# EAGLE design panel (EAGLE 6.5.0)
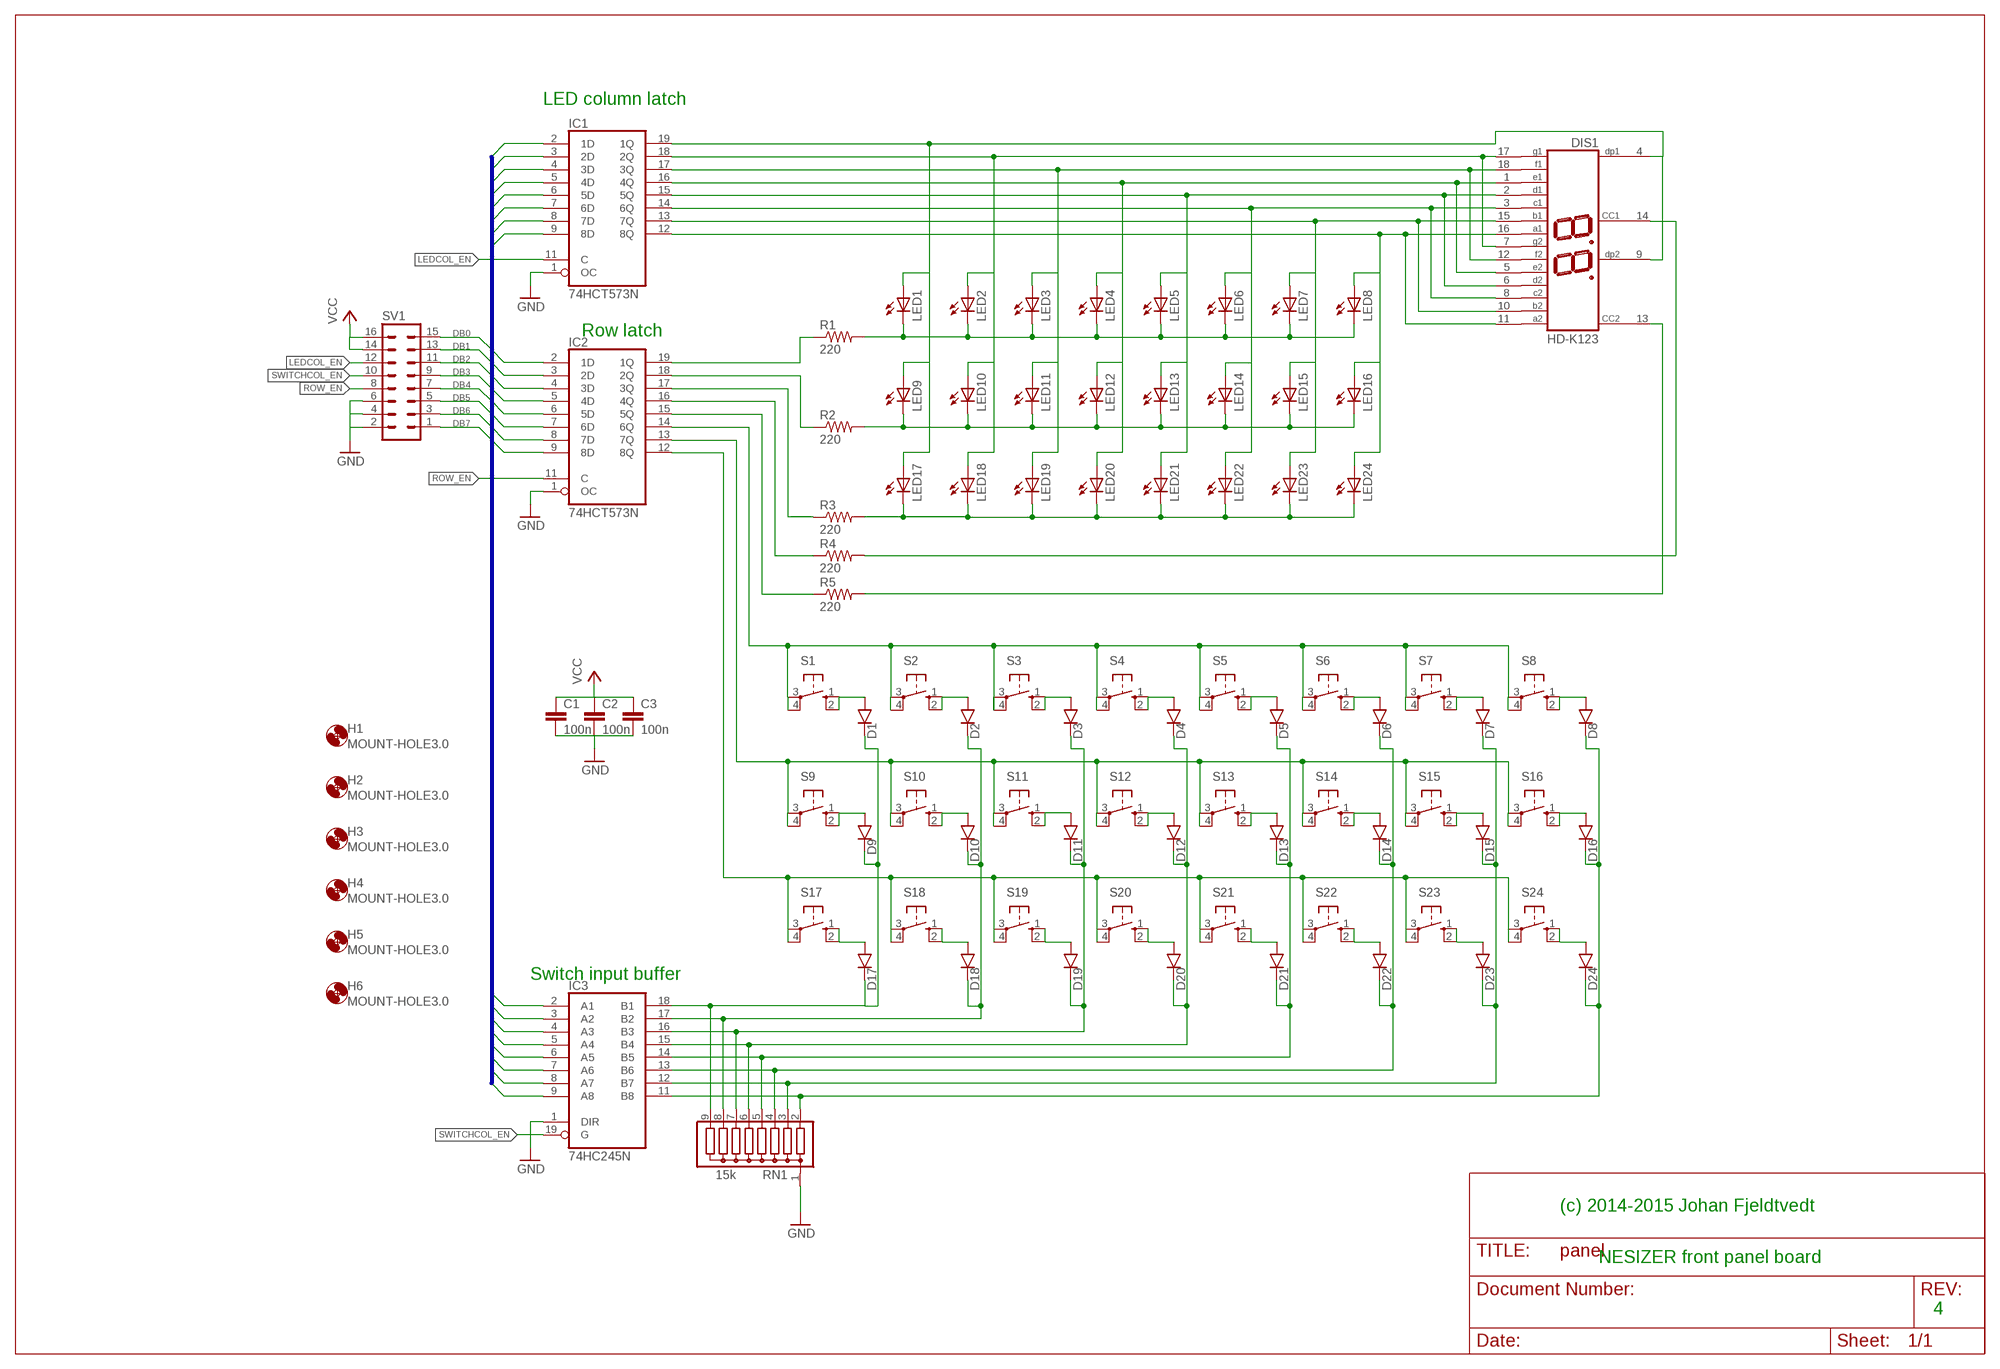
[diagram p0: schematic, sheet 1]

## Parts
C1  100n  C-EU025-025X050  [C025-025X050]
C2  100n  C-EU025-025X050  [C025-025X050]
C3  100n  C-EU025-025X050  [C025-025X050]
D1  1N914.3  [DO35-3]
D2  1N914.3  [DO35-3]
D3  1N914.3  [DO35-3]
D4  1N914.3  [DO35-3]
D5  1N914.3  [DO35-3]
D6  1N914.3  [DO35-3]
D7  1N914.3  [DO35-3]
D8  1N914.3  [DO35-3]
D9  1N914.3  [DO35-3]
D10  1N914.3  [DO35-3]
D11  1N914.3  [DO35-3]
D12  1N914.3  [DO35-3]
D13  1N914.3  [DO35-3]
D14  1N914.3  [DO35-3]
D15  1N914.3  [DO35-3]
D16  1N914.3  [DO35-3]
D17  1N914.3  [DO35-3]
D18  1N914.3  [DO35-3]
D19  1N914.3  [DO35-3]
D20  1N914.3  [DO35-3]
D21  1N914.3  [DO35-3]
D22  1N914.3  [DO35-3]
D23  1N914.3  [DO35-3]
D24  1N914.3  [DO35-3]
DIS1  HD-K123  [HDSP-R]
H1  MOUNT-HOLE3.0  [3,0]
H2  MOUNT-HOLE3.0  [3,0]
H3  MOUNT-HOLE3.0  [3,0]
H4  MOUNT-HOLE3.0  [3,0]
H5  MOUNT-HOLE3.0  [3,0]
H6  MOUNT-HOLE3.0  [3,0]
IC1  74HCT573N  [DIL20]
IC2  74HCT573N  [DIL20]
IC3  74HC245N  [DIL20]
LED1  LED3MM  [LED3MM]
LED2  LED3MM  [LED3MM]
LED3  LED3MM  [LED3MM]
LED4  LED3MM  [LED3MM]
LED5  LED3MM  [LED3MM]
LED6  LED3MM  [LED3MM]
LED7  LED3MM  [LED3MM]
LED8  LED3MM  [LED3MM]
LED9  LED3MM  [LED3MM]
LED10  LED3MM  [LED3MM]
LED11  LED3MM  [LED3MM]
LED12  LED3MM  [LED3MM]
LED13  LED3MM  [LED3MM]
LED14  LED3MM  [LED3MM]
LED15  LED3MM  [LED3MM]
LED16  LED3MM  [LED3MM]
LED17  LED3MM  [LED3MM]
LED18  LED3MM  [LED3MM]
LED19  LED3MM  [LED3MM]
LED20  LED3MM  [LED3MM]
LED21  LED3MM  [LED3MM]
LED22  LED3MM  [LED3MM]
LED23  LED3MM  [LED3MM]
LED24  LED3MM  [LED3MM]
R1  220  R-US_0207/7  [0207/7]
R2  220  R-US_0207/7  [0207/7]
R3  220  R-US_0207/7  [0207/7]
R4  220  R-US_0207/7  [0207/7]
R5  220  R-US_0207/7  [0207/7]
RN1  15k  G08R  [SIL9]
S1  40-XX  [B3F-40XX]
S2  40-XX  [B3F-40XX]
S3  40-XX  [B3F-40XX]
S4  40-XX  [B3F-40XX]
S5  40-XX  [B3F-40XX]
S6  40-XX  [B3F-40XX]
S7  40-XX  [B3F-40XX]
S8  40-XX  [B3F-40XX]
S9  40-XX  [B3F-40XX]
S10  40-XX  [B3F-40XX]
S11  40-XX  [B3F-40XX]
S12  40-XX  [B3F-40XX]
S13  40-XX  [B3F-40XX]
S14  40-XX  [B3F-40XX]
S15  40-XX  [B3F-40XX]
S16  40-XX  [B3F-40XX]
S17  10-XX  [B3F-10XX]
S18  10-XX  [B3F-10XX]
S19  10-XX  [B3F-10XX]
S20  10-XX  [B3F-10XX]
S21  10-XX  [B3F-10XX]
S22  10-XX  [B3F-10XX]
S23  10-XX  [B3F-10XX]
S24  10-XX  [B3F-10XX]
SV1  MA08-2  [MA08-2]

## Nets
DB0: IC1.2(1D) IC2.2(1D) IC3.2(A1) SV1.15
DB1: IC1.3(2D) IC2.3(2D) IC3.3(A2) SV1.13
DB2: IC1.4(3D) IC2.4(3D) IC3.4(A3) SV1.11
DB3: IC1.5(4D) IC2.5(4D) IC3.5(A4) SV1.9
DB4: IC1.6(5D) IC2.6(5D) IC3.6(A5) SV1.7
DB5: IC1.7(6D) IC2.7(6D) IC3.7(A6) SV1.5
DB6: IC1.8(7D) IC2.8(7D) IC3.8(A7) SV1.3
DB7: IC1.9(8D) IC2.9(8D) IC3.9(A8) SV1.1
GND: C1.2 C2.2 C3.2 IC1.1(OC) IC2.1(OC) IC3.1(DIR) RN1.1 SV1.2 SV1.4 SV1.6
LEDCOL_EN: IC1.11(C) SV1.12
N$1: LED1.K(C) LED2.K(C) LED3.K(C) LED4.K(C) LED5.K(C) LED6.K(C) LED7.K(C) LED8.K(C) R1.2
N$2: LED17.K(C) LED18.K(C) LED19.K(C) LED20.K(C) LED21.K(C) LED22.K(C) LED23.K(C) LED24.K(C) R3.2
N$3: DIS1.4(DP1) DIS1.9(DP2) IC1.19(1Q) LED1.A LED9.A LED17.A
N$4: DIS1.7(G2) DIS1.17(G1) IC1.18(2Q) LED2.A LED10.A LED18.A
N$5: DIS1.12(F2) DIS1.18(F1) IC1.17(3Q) LED3.A LED11.A LED19.A
N$6: DIS1.1(E1) DIS1.5(E2) IC1.16(4Q) LED4.A LED12.A LED20.A
N$7: DIS1.2(D1) DIS1.6(D2) IC1.15(5Q) LED5.A LED13.A LED21.A
N$8: DIS1.3(C1) DIS1.8(C2) IC1.14(6Q) LED6.A LED14.A LED22.A
N$9: DIS1.10(B2) DIS1.15(B1) IC1.13(7Q) LED7.A LED15.A LED23.A
N$10: DIS1.11(A2) DIS1.16(A1) IC1.12(8Q) LED8.A LED16.A LED24.A
N$11: LED9.K(C) LED10.K(C) LED11.K(C) LED12.K(C) LED13.K(C) LED14.K(C) LED15.K(C) LED16.K(C) R2.2
N$12: IC2.19(1Q) R1.1
N$13: DIS1.13(CC2) R5.2
N$14: DIS1.14(CC1) R4.2
N$16: IC2.17(3Q) R3.1
N$17: IC2.15(5Q) R5.1
N$18: IC2.16(4Q) R4.1
N$19: IC2.13(7Q) S9.3(P) S9.4(P1) S10.3(P) S10.4(P1) S11.3(P) S11.4(P1) S12.3(P) S12.4(P1) S13.3(P) S13.4(P1) S14.3(P) S14.4(P1) S15.3(P) S15.4(P1) S16.3(P) S16.4(P1)
N$20: IC2.18(2Q) R2.1
N$21: IC2.14(6Q) S1.3(P) S1.4(P1) S2.3(P) S2.4(P1) S3.3(P) S3.4(P1) S4.3(P) S4.4(P1) S5.3(P) S5.4(P1) S6.3(P) S6.4(P1) S7.3(P) S7.4(P1) S8.3(P) S8.4(P1)
N$22: D2.C D10.C D18.C IC3.17(B2) RN1.8
N$23: D1.C D9.C D17.C IC3.18(B1) RN1.9
N$24: D9.A S9.1(S) S9.2(S1)
N$25: D2.A S2.1(S) S2.2(S1)
N$26: IC2.12(8Q) S17.3(P) S17.4(P1) S18.3(P) S18.4(P1) S19.3(P) S19.4(P1) S20.3(P) S20.4(P1) S21.3(P) S21.4(P1) S22.3(P) S22.4(P1) S23.3(P) S23.4(P1) S24.3(P) S24.4(P1)
N$27: D17.A S17.1(S) S17.2(S1)
N$28: D18.A S18.1(S) S18.2(S1)
N$29: D19.A S19.1(S) S19.2(S1)
N$30: D20.A S20.1(S) S20.2(S1)
N$31: D21.A S21.1(S) S21.2(S1)
N$32: D11.A S11.1(S) S11.2(S1)
N$33: D10.A S10.1(S) S10.2(S1)
N$34: D4.A S4.1(S) S4.2(S1)
N$35: D12.A S12.1(S) S12.2(S1)
N$36: D3.A S3.1(S) S3.2(S1)
N$37: D3.C D11.C D19.C IC3.16(B3) RN1.7
N$38: D5.A S5.1(S) S5.2(S1)
N$39: D13.A S13.1(S) S13.2(S1)
N$40: D6.A S6.1(S) S6.2(S1)
N$41: D14.A S14.1(S) S14.2(S1)
N$42: D22.A S22.1(S) S22.2(S1)
N$43: D7.A S7.1(S) S7.2(S1)
N$44: D15.A S15.1(S) S15.2(S1)
N$45: D23.A S23.1(S) S23.2(S1)
N$46: D8.A S8.1(S) S8.2(S1)
N$47: D16.A S16.1(S) S16.2(S1)
N$48: D24.A S24.1(S) S24.2(S1)
N$49: D4.C D12.C D20.C IC3.15(B4) RN1.6
N$50: D5.C D13.C D21.C IC3.14(B5) RN1.5
N$51: D6.C D14.C D22.C IC3.13(B6) RN1.4
N$52: D7.C D15.C D23.C IC3.12(B7) RN1.3
N$53: D8.C D16.C D24.C IC3.11(B8) RN1.2
N$54: D1.A S1.1(S) S1.2(S1)
ROW_EN: IC2.11(C) SV1.8
SWITCHCOL_EN: IC3.19(G) SV1.10
VCC: C1.1 C2.1 C3.1 SV1.14 SV1.16

## Buses
DB[0..7]

## Notes on the sheet
- LED column latch
- Row latch
- Switch input buffer
- (c) 2014-2015 Johan Fjeldtvedt
- NESIZER front panel board
- 4

## Power pins joined to a net without a drawn wire
GND: IC1.10(GND) IC2.10(GND) IC3.10(GND)
VCC: IC1.20(VCC) IC2.20(VCC) IC3.20(VCC)

## Library data of the parts
C1-C3 = rcl:C-EU: CAPACITOR, European symbol
D1-D24 = gm-diodes:1N914: Fast Switching Diode DO-35 glass case a.k.a. 1N4148
DIS1 = display-hp:HD-K123: LED DISPLAY 2 x 1 character 7 segment, decimal points right; OC_FARNELL: unknown; OC_NEWARK: unknown
H1-H6 = holes:MOUNT-HOLE: MOUNTING HOLE with drill center marker
IC1 IC2 = 74xx-eu:74*573: 8-bit D latch BUS DRIVER
IC3 = 74xx-eu:74*245: Octal BUS TRANSCEIVER, 3-state
LED1-LED24 = led:LED: LED OSRAM: - CHIPLED LG R971, LG N971, LY N971, LG Q971, LY Q971, LO R971, LY R971 LH N974, LH R974 LS Q976, LO Q976, LY Q976 LO Q996 - Hyper CHIPLED LW Q18S LB Q993, LB Q99A, LB R99A - SideLED LS A670, LO A670, LY A670, LG A670, LP A670 LB A673, LV A673, LT A673, LW A673 LH A674 LY A675 LS A676, LA A676, LO A676, LY A676, LW A676 LS A679, LY A679, LG A679 - Hyper Micro SIDELED® LS Y876, LA Y876, LO Y876, LY Y876 LT Y87S - SmartLED LW L88C, LW L88S LB L89C, LB L89S, LG L890 LS L89K, LO L89K, LY L89K LS L896, LA L896, LO L896, LY L896 - TOPLED LS T670, LO T670, LY T670, LG T670, LP T670 LSG T670, LSP T670, LSY T670, LOP T670, LYG T670 LG T671, LOG T671, LSG T671 LB T673, LV T673, LT T673, LW T673 LH T674 LS T676, LA T676, LO T676, LY T676, LB T676, LH T676, LSB T676, LW T676 LB T67C, LV T67C, LT T67C, LS T67K, LO T67K, LY T67K, LW E67C LS E67B, LA E67B, LO E67B, LY E67B, LB E67C, LV E67C, LT E67C LW T67C LS T679, LY T679, LG T679 LS T770, LO T770, LY T770, LG T770, LP T770 LB T773, LV T773, LT T773, LW T773 LH T774 LS E675, LA E675, LY E675, LS T675 LS T776, LA T776, LO T776, LY T776, LB T776 LHGB T686 LT T68C, LB T68C - Hyper Mini TOPLED® LB M676 - Mini TOPLED Santana® LG M470 LS M47K, LO M47K, LY M47K Source: http://www.osram.convergy.de LUXEON: - LUMILED® LXK2-PW12-R00, LXK2-PW12-S00, LXK2-PW14-U00, LXK2-PW14-V00 LXK2-PM12-R00, LXK2-PM12-S00, LXK2-PM14-U00 LXK2-PE12-Q00, LXK2-PE12-R00, LXK2-PE12-S00, LXK2-PE14-T00, LXK2-PE14-U00 LXK2-PB12-K00, LXK2-PB12-L00, LXK2-PB12-M00, LXK2-PB14-N00, LXK2-PB14-P00, LXK2-PB14-Q00 LXK2-PR12-L00, LXK2-PR12-M00, LXK2-PR14-Q00, LXK2-PR14-R00 LXK2-PD12-Q00, LXK2-PD12-R00, LXK2-PD12-S00 LXK2-PH12-R00, LXK2-PH12-S00 LXK2-PL12-P00, LXK2-PL12-Q00, LXK2-PL12-R00 Source: www.luxeon.com KINGBRIGHT: KA-3528ASYC Source: www.kingbright.com
R1-R5 = rcl:R-US_: RESISTOR, American symbol
RN1 = resistor-sil:G08R: SIL RESISTOR; OC_FARNELL: unknown; OC_NEWARK: unknown
S1-S16 = switch-omron:40-XX: OMRON SWITCH; MF: OMRON COMPONENTS USA; MPN: B3F-4000; OC_FARNELL: 176434; OC_NEWARK: 36K3105
S17-S24 = switch-omron:10-XX: OMRON SWITCH; MPN: B3F-1000; OC_FARNELL: 176432; OC_NEWARK: 36M3542
SV1 = con-lstb:MA08-2: PIN HEADER; OC_FARNELL: unknown; OC_NEWARK: unknown

## Board
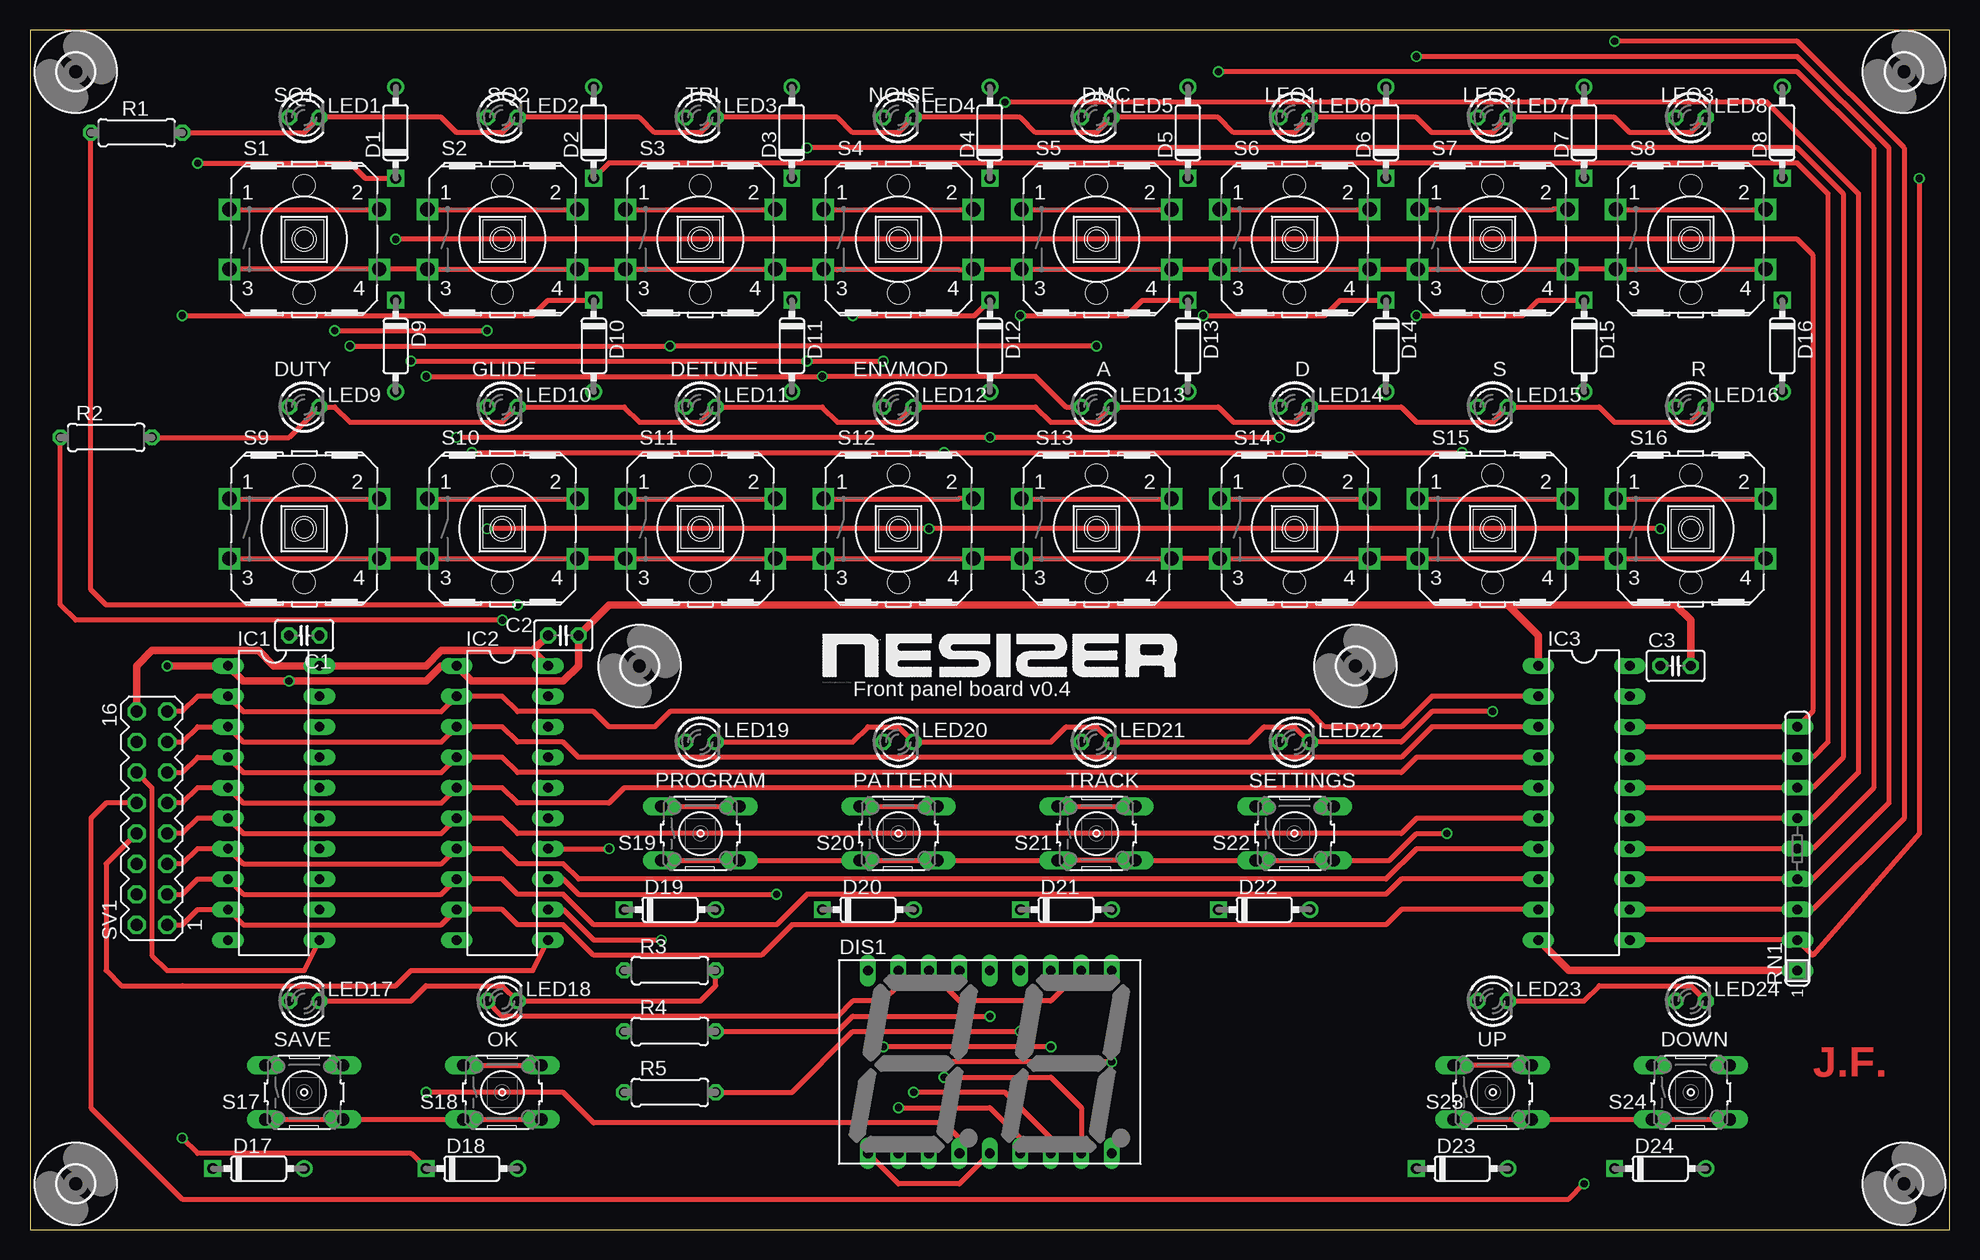
[diagram p1: board, top side]
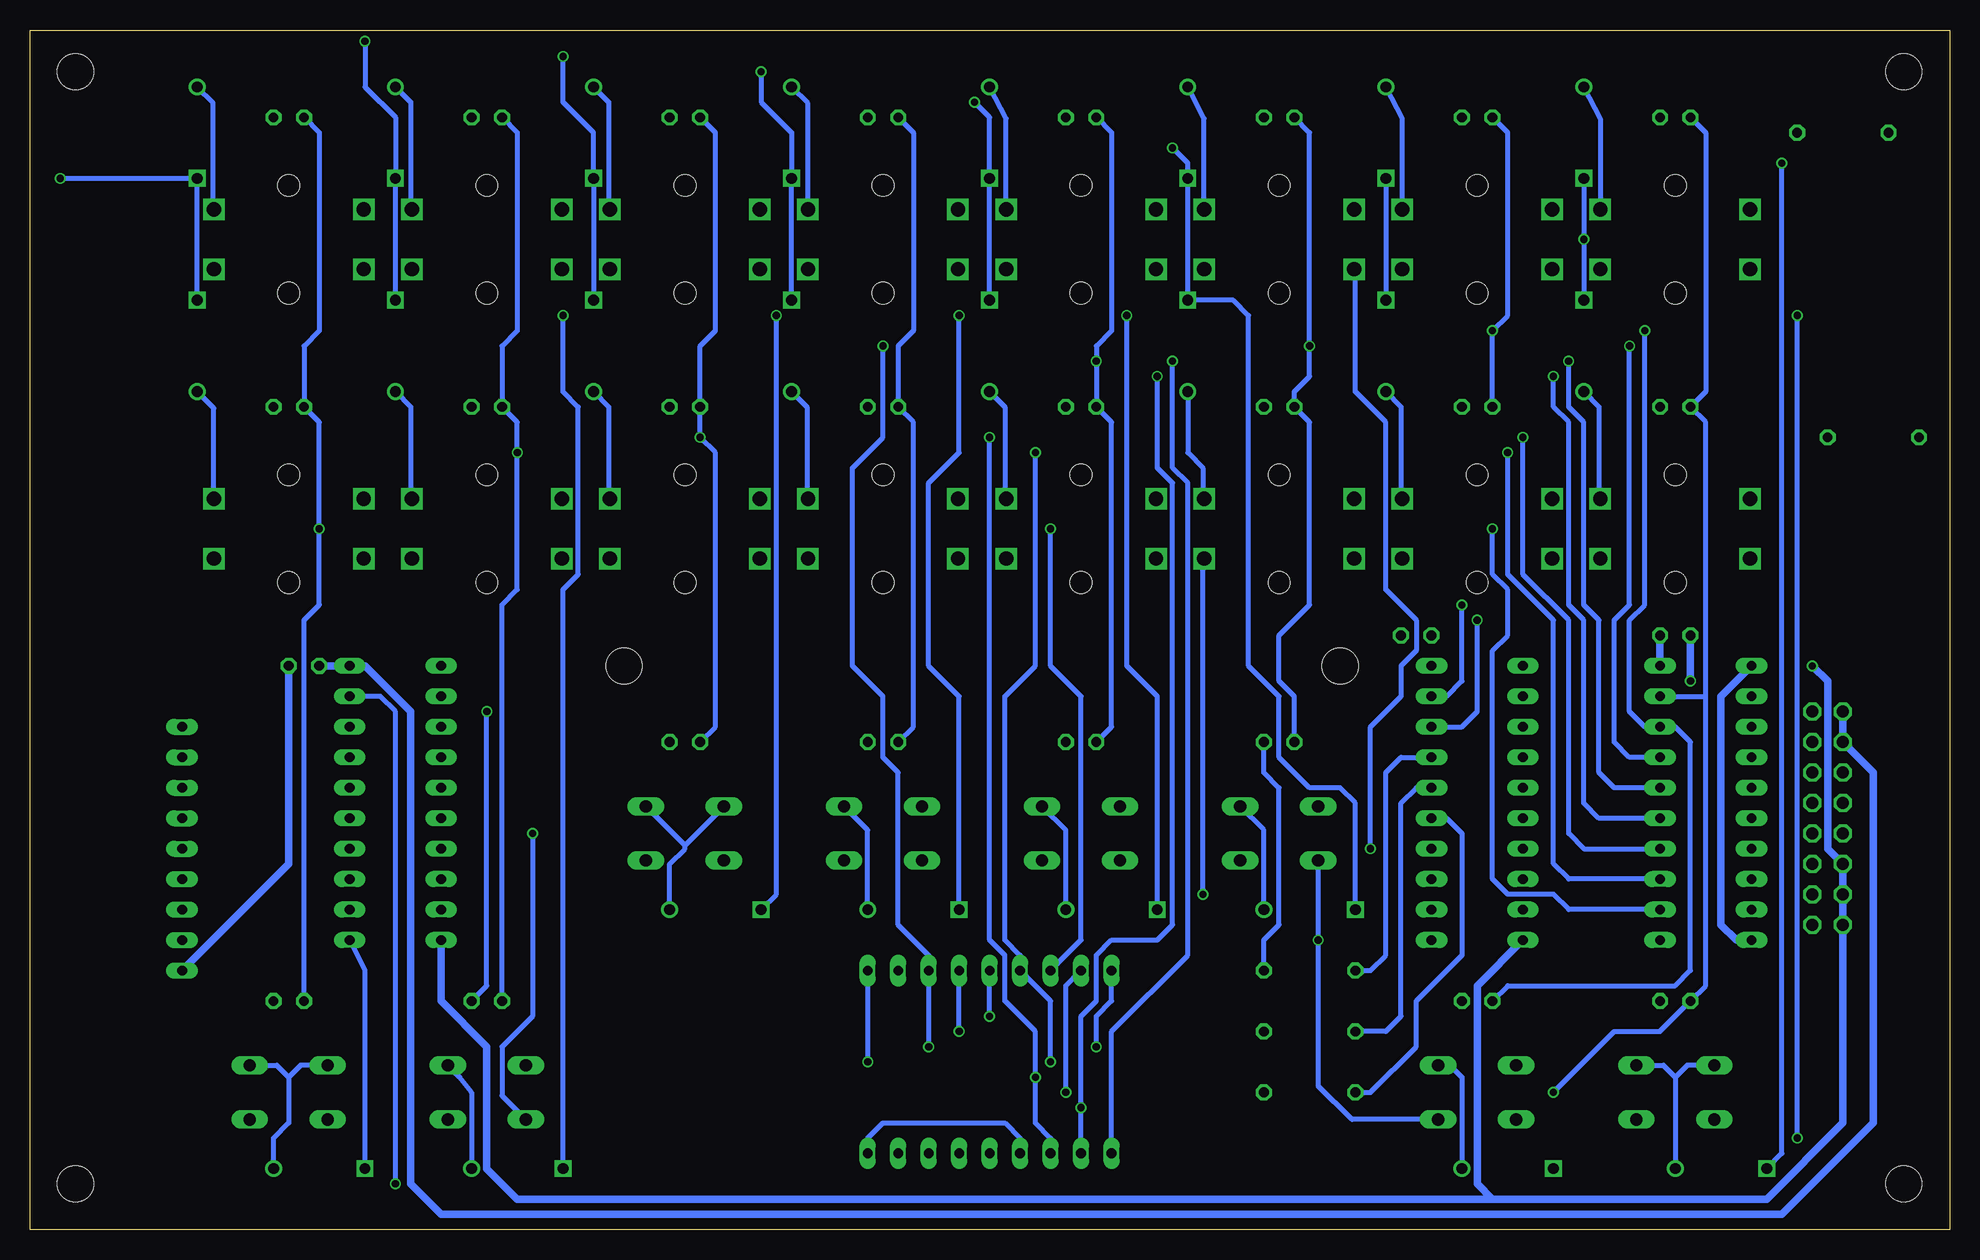
[diagram p2: board, bottom side, seen from below]

Size 160 x 100 mm. Coordinates in mm from the lower left corner, seen from the top.
Outline: 0,0 160,0 160,100 0,100 0,0
Copper layers (1*16): Top 0.035mm / dielectric 1.5mm / Bottom 0.035mm
Design rules "Elecrow_2-layer_eagle_rule": minimum track width 6mil, minimum drill 12mil, track to track 6mil, track to pad 6mil, pad to pad 6mil, via to via 6mil, smd to smd 0mil, copper to edge 10mil, drill to drill 10mil, minimum pad ring 10mil, minimum via ring 6mil, stop-mask expansion 2mil, vias tented up to drill 100mil, thermal gap 10mil

### Footprints (pad centres in the part's own frame; a part is rotated, then mirrored left to right if it is on the bottom)
C025-025X050 = drill 0.813 octagon: 1 -1.27,0; 2 1.27,0
DO35-3 = drill 0.9: A 3.81,0 | drill 0.9 square: C -3.81,0
HDSP-R = drill 0.813 long: 1 -10.16,-7.62; 2 -7.62,-7.62; 3 -5.08,-7.62; 4 -2.54,-7.62; 5 0,-7.62; 6 2.54,-7.62; 7 5.08,-7.62; 8 7.62,-7.62; 9 10.16,-7.62; 10 10.16,7.62; 11 7.62,7.62; 12 5.08,7.62; 13 2.54,7.62; 14 0,7.62; 15 -2.54,7.62; 16 -5.08,7.62; 17 -7.62,7.62; 18 -10.16,7.62
3,0 = hole 3: 0,0
DIL20 = drill 0.813 long: 1 -11.43,-3.81; 2 -8.89,-3.81; 3 -6.35,-3.81; 4 -3.81,-3.81; 5 -1.27,-3.81; 6 1.27,-3.81; 7 3.81,-3.81; 8 6.35,-3.81; 9 8.89,-3.81; 10 11.43,-3.81; 11 11.43,3.81; 12 8.89,3.81; 13 6.35,3.81; 14 3.81,3.81; 15 1.27,3.81; 16 -1.27,3.81; 17 -3.81,3.81; 18 -6.35,3.81; 19 -8.89,3.81; 20 -11.43,3.81
LED3MM = drill 0.813 octagon: A -1.27,0; K 1.27,0
0207/7 = drill 0.813 octagon: 1 -3.81,0; 2 3.81,0
SIL9 = drill 0.813 long: 1 -10.16,0; 2 -7.62,0; 3 -5.08,0; 4 -2.54,0; 5 0,0; 6 2.54,0; 7 5.08,0; 8 7.62,0; 9 10.16,0
B3F-40XX = drill 1.194 square: 1 -6.248,2.489; 2 6.248,2.489; 3 -6.248,-2.489; 4 6.248,-2.489 | hole 1.803: 0,-4.496; 0,4.496
B3F-10XX = drill 1.016 long: 1 -3.251,2.261; 2 3.251,2.261; 3 -3.251,-2.261; 4 3.251,-2.261
MA08-2 = drill 1.016 octagon: 1 -8.89,-1.27; 2 -8.89,1.27; 3 -6.35,-1.27; 4 -6.35,1.27; 5 -3.81,-1.27; 6 -3.81,1.27; 7 -1.27,-1.27; 8 -1.27,1.27; 9 1.27,-1.27; 10 1.27,1.27; 11 3.81,-1.27; 12 3.81,1.27; 13 6.35,-1.27; 14 6.35,1.27; 15 8.89,-1.27; 16 8.89,1.27

### Placement (x,y rotation side)
C1  22.86,49.53 180 top
C2  44.45,49.53 0 top
C3  137.16,46.99 0 top
D1  30.48,91.44 90 top
D2  46.99,91.44 90 top
D3  63.5,91.44 90 top
D4  80.01,91.44 90 top
D5  96.52,91.44 90 top
D6  113.03,91.44 90 top
D7  129.54,91.44 90 top
D8  146.05,91.44 90 top
D9  30.48,73.66 270 top
D10  46.99,73.66 270 top
D11  63.5,73.66 270 top
D12  80.01,73.66 270 top
D13  96.52,73.66 270 top
D14  113.03,73.66 270 top
D15  129.54,73.66 270 top
D16  146.05,73.66 270 top
D17  19.05,5.08 0 top
D18  36.83,5.08 0 top
D19  53.34,26.67 0 top
D20  69.85,26.67 0 top
D21  86.36,26.67 0 top
D22  102.87,26.67 0 top
D23  119.38,5.08 0 top
D24  135.89,5.08 0 top
DIS1  80.01,13.97 0 top
H1  156.21,3.81 0 top
H2  3.81,3.81 0 top
H3  156.21,96.52 0 top
H4  3.81,96.52 0 top
H5  110.49,46.99 0 top
H6  50.8,46.99 0 top
IC1  20.32,35.56 270 top
IC2  39.37,35.56 270 top
IC3  129.54,35.56 270 top
LED1  22.86,92.71 0 top
LED2  39.37,92.71 0 top
LED3  55.88,92.71 0 top
LED4  72.39,92.71 0 top
LED5  88.9,92.71 0 top
LED6  105.41,92.71 0 top
LED7  121.92,92.71 0 top
LED8  138.43,92.71 0 top
LED9  22.86,68.58 0 top
LED10  39.37,68.58 0 top
LED11  55.88,68.58 0 top
LED12  72.39,68.58 0 top
LED13  88.9,68.58 0 top
LED14  105.41,68.58 0 top
LED15  121.92,68.58 0 top
LED16  138.43,68.58 0 top
LED17  22.86,19.05 0 top
LED18  39.37,19.05 0 top
LED19  55.88,40.64 0 top
LED20  72.39,40.64 0 top
LED21  88.9,40.64 0 top
LED22  105.41,40.64 0 top
LED23  121.92,19.05 0 top
LED24  138.43,19.05 0 top
R1  8.89,91.44 0 top
R2  6.35,66.04 0 top
R3  53.34,21.59 0 top
R4  53.34,16.51 0 top
R5  53.34,11.43 0 top
RN1  147.32,31.75 90 top
S1  22.86,82.55 0 top
S2  39.37,82.55 0 top
S3  55.88,82.55 0 top
S4  72.39,82.55 0 top
S5  88.9,82.55 0 top
S6  105.41,82.55 0 top
S7  121.92,82.55 0 top
S8  138.43,82.55 0 top
S9  22.86,58.42 0 top
S10  39.37,58.42 0 top
S11  55.88,58.42 0 top
S12  72.39,58.42 0 top
S13  88.9,58.42 0 top
S14  105.41,58.42 0 top
S15  121.92,58.42 0 top
S16  138.43,58.42 0 top
S17  22.86,11.43 0 top
S18  39.37,11.43 0 top
S19  55.88,33.02 0 top
S20  72.39,33.02 0 top
S21  88.9,33.02 0 top
S22  105.41,33.02 0 top
S23  121.92,11.43 0 top
S24  138.43,11.43 0 top
SV1  10.16,34.29 90 top
U$1  [NESIZER_LOGO]  66.04,45.72 0 top

### Tracks (layer width: path | path; a pad name or v marks a point on that pad's centre or on a via)
DB0
  Top 0.406: SV1.15 12.7,43.18 13.97,44.45 IC1.2 17.78,43.18 34.29,43.18 IC2.2 39.37,44.45 40.64,43.18 46.99,43.18 48.26,41.91 52.07,41.91 53.34,43.18 106.68,43.18 107.95,41.91 114.3,41.91 116.84,44.45 IC3.2
DB1
  Top 0.406: SV1.13 12.7,40.64 13.97,41.91 IC1.3 17.78,40.64 34.29,40.64 IC2.3 39.37,41.91 40.64,40.64 44.45,40.64 45.72,39.37 114.3,39.37 116.84,41.91 IC3.3
DB2
  Top 0.406: SV1.11 12.7,38.1 13.97,39.37 IC1.4 17.78,38.1 34.29,38.1 IC2.4 39.37,39.37 40.64,38.1 114.3,38.1 115.57,39.37 IC3.4
DB3
  Top 0.406: SV1.9 12.7,35.56 13.97,36.83 IC1.5 17.78,35.56 34.29,35.56 IC2.5 39.37,36.83 40.64,35.56 48.26,35.56 49.53,36.83 IC3.5
DB4
  Top 0.406: SV1.7 12.7,33.02 13.97,34.29 IC1.6 17.78,33.02 34.29,33.02 IC2.6 39.37,34.29 40.64,33.02 114.3,33.02 115.57,34.29 IC3.6
DB5
  Top 0.406: IC3.7 115.57,31.75 113.03,29.21 45.72,29.21 44.45,30.48 40.64,30.48 39.37,31.75 IC2.7 34.29,30.48 17.78,30.48 IC1.7 13.97,31.75 12.7,30.48 SV1.5
DB6
  Top 0.406: SV1.3 12.7,27.94 13.97,29.21 IC1.8 17.78,27.94 34.29,27.94 IC2.8 39.37,29.21 40.64,27.94 44.45,27.94 46.99,25.4 62.23,25.4 64.77,27.94 113.03,27.94 114.3,29.21 IC3.8
DB7
  Top 0.406: SV1.1 12.7,25.4 13.97,26.67 IC1.9 17.78,25.4 34.29,25.4 IC2.9 39.37,26.67 40.64,25.4 44.45,25.4 46.99,22.86 60.96,22.86 63.5,25.4 113.03,25.4 114.3,26.67 IC3.9
GND  (via drill 0.6)
  Top 0.61: C3.2 138.43,50.8 137.16,52.07 123.19,52.07 | 123.19,52.07 48.26,52.07 C2.2 45.72,46.99 44.45,45.72 36.83,45.72 IC2.1 34.29,46.99 33.02,45.72 v21.59,45.72 17.78,45.72 IC1.1 v11.43,46.99 | IC3.10 128.27,21.59 RN1.1 | IC3.1 125.73,49.53 123.19,52.07
  Bottom 0.61: C3.2 138.43,30.48 RN1.1 | IC1.10 17.78,24.13 19.05,25.4 19.05,44.45 IC1.1 | 38.1,2.54 15.24,2.54 8.89,8.89 SV1.2 SV1.4 SV1.6 10.16,31.75 10.16,45.72 v11.43,46.99 | 38.1,2.54 119.38,2.54 121.92,5.08 121.92,15.24 125.73,19.05 IC3.10 | IC2.10 39.37,20.32 39.37,3.81 38.1,2.54 | C1.2 v21.59,45.72
LEDCOL_EN
  Top 0.406: SV1.12 10.16,36.83 10.16,22.86 11.43,21.59 22.86,21.59 IC1.11
N$1
  Top 0.406: LED8.K 138.43,91.44 133.35,91.44 132.08,92.71 LED7.K 121.92,91.44 116.84,91.44 115.57,92.71 LED6.K 105.41,91.44 100.33,91.44 99.06,92.71 LED5.K 88.9,91.44 83.82,91.44 82.55,92.71 LED4.K 72.39,91.44 68.58,91.44 67.31,92.71 LED3.K 55.88,91.44 52.07,91.44 50.8,92.71 LED2.K 39.37,91.44 35.56,91.44 34.29,92.71 LED1.K 22.86,91.44 R1.2
N$2  (via drill 0.6)
  Top 0.406: LED23.K 129.54,19.05 130.81,20.32 138.43,20.32 LED24.K | LED17.K 31.75,19.05 33.02,20.32 39.37,20.32 LED18.K 55.88,19.05 57.15,20.32 R3.2 | v121.92,43.18 116.84,43.18 114.3,40.64 LED22.K 105.41,41.91 102.87,41.91 101.6,40.64 LED21.K 88.9,41.91 86.36,41.91 85.09,40.64 LED20.K 72.39,41.91 69.85,41.91 68.58,40.64 LED19.K
  Bottom 0.406: LED23.K 121.92,20.32 v121.92,43.18 | R3.2 57.15,24.13 55.88,25.4 55.88,36.83 57.15,38.1 LED19.K
N$3  (via drill 0.6)
  Top 0.406: DIS1.4 77.47,7.62 76.2,8.89 46.99,8.89 44.45,11.43 v33.02,11.43
  Bottom 0.406: IC1.19 20.32,44.45 | 20.32,44.45 20.32,67.31 LED9.A 20.32,69.85 20.32,91.44 LED1.A | 20.32,44.45 20.32,20.32 LED17.A 24.13,16.51 27.94,16.51 v33.02,11.43 | DIS1.9 90.17,7.62 88.9,8.89 78.74,8.89 77.47,7.62 DIS1.4
N$4  (via drill 0.6)
  Top 0.406: DIS1.7 85.09,7.62 81.28,11.43 v73.66,11.43 | DIS1.17 72.39,20.32 71.12,19.05 68.58,19.05 67.31,17.78 39.37,17.78 LED18.A | v25.4,74.93 v38.1,74.93
  Bottom 0.406: v73.66,11.43 73.66,20.32 DIS1.17 | LED18.A 36.83,20.32 22.86,20.32 21.59,21.59 21.59,40.64 22.86,41.91 IC1.18 25.4,41.91 26.67,43.18 26.67,50.8 25.4,52.07 v25.4,74.93 | LED10.A v38.1,74.93 36.83,76.2 36.83,91.44 LED2.A
N$5  (via drill 0.6)
  Top 0.406: v88.9,73.66 v53.34,73.66 v26.67,73.66 | v85.09,15.24 v71.12,15.24
  Bottom 0.406: v26.67,73.66 26.67,52.07 27.94,50.8 27.94,40.64 26.67,39.37 IC1.17 | LED3.A 53.34,91.44 v53.34,73.66 53.34,71.12 54.61,69.85 LED11.A 53.34,67.31 53.34,52.07 55.88,49.53 55.88,45.72 54.61,44.45 LED19.A | v85.09,15.24 DIS1.12 85.09,22.86 87.63,25.4 87.63,38.1 88.9,39.37 88.9,44.45 91.44,46.99 91.44,63.5 88.9,66.04 v88.9,73.66 | v71.12,15.24 71.12,17.78 69.85,19.05 DIS1.18
N$6  (via drill 0.6)
  Top 0.406: DIS1.5 77.47,3.81 72.39,3.81 DIS1.1 | v31.75,72.39 v64.77,72.39 v71.12,72.39
  Bottom 0.406: v31.75,72.39 31.75,68.58 30.48,67.31 30.48,52.07 29.21,50.8 29.21,38.1 27.94,36.83 IC1.16 | DIS1.1 69.85,16.51 63.5,22.86 63.5,62.23 64.77,63.5 v64.77,72.39 | LED20.A 69.85,41.91 69.85,67.31 LED12.A v71.12,72.39 71.12,73.66 69.85,74.93 69.85,91.44 LED4.A
N$7  (via drill 0.6)
  Top 0.406: v72.39,10.16 80.01,10.16 82.55,7.62 DIS1.6 | v33.02,71.12 v66.04,71.12 83.82,71.12 86.36,68.58 LED13.A
  Bottom 0.406: v33.02,71.12 33.02,68.58 31.75,67.31 31.75,52.07 30.48,50.8 30.48,35.56 29.21,34.29 IC1.15 | v66.04,71.12 66.04,63.5 64.77,62.23 64.77,25.4 66.04,24.13 69.85,24.13 71.12,22.86 71.12,19.05 72.39,17.78 v72.39,10.16 DIS1.2 | LED21.A 86.36,41.91 86.36,67.31 LED13.A 87.63,73.66 86.36,74.93 86.36,91.44 LED5.A
N$8  (via drill 0.6)
  Top 0.406: v76.2,12.7 85.09,12.7 87.63,10.16 DIS1.8 | v104.14,66.04 v80.01,66.04 v35.56,66.04
  Bottom 0.406: v35.56,66.04 35.56,54.61 31.75,50.8 31.75,33.02 30.48,31.75 IC1.14 | DIS1.3 74.93,7.62 76.2,8.89 v76.2,12.7 76.2,16.51 78.74,19.05 78.74,22.86 80.01,24.13 v80.01,66.04 | LED22.A 102.87,41.91 102.87,64.77 v104.14,66.04 LED14.A 104.14,73.66 102.87,74.93 102.87,91.44 LED6.A
N$9  (via drill 0.6)
  Top 0.406: v90.17,13.97 v74.93,13.97 | v36.83,64.77 v76.2,64.77 v119.38,64.77
  Bottom 0.406: v36.83,64.77 36.83,54.61 33.02,50.8 33.02,30.48 31.75,29.21 IC1.13 | LED23.A 120.65,52.07 119.38,53.34 v119.38,64.77 119.38,67.31 LED15.A 120.65,73.66 119.38,74.93 119.38,91.44 LED7.A | v76.2,64.77 76.2,46.99 78.74,44.45 78.74,24.13 77.47,22.86 DIS1.15 74.93,19.05 v74.93,13.97 | DIS1.10 v90.17,13.97
N$10  (via drill 0.6)
  Top 0.406: v135.89,58.42 v74.93,58.42 v38.1,58.42 | DIS1.11 85.09,19.05 77.47,19.05 DIS1.16
  Bottom 0.406: v38.1,58.42 38.1,54.61 36.83,53.34 36.83,49.53 38.1,48.26 38.1,29.21 36.83,27.94 33.02,27.94 31.75,26.67 IC1.12 | LED24.A 137.16,50.8 135.89,52.07 v135.89,58.42 135.89,67.31 LED16.A 137.16,73.66 135.89,74.93 135.89,91.44 LED8.A | DIS1.16 72.39,24.13 72.39,44.45 74.93,46.99 v74.93,58.42
N$11
  Top 0.406: R2.2 21.59,66.04 LED9.K 25.4,68.58 26.67,67.31 39.37,67.31 LED10.K 49.53,68.58 50.8,67.31 55.88,67.31 LED11.K 66.04,68.58 67.31,67.31 72.39,67.31 LED12.K 83.82,68.58 85.09,67.31 88.9,67.31 LED13.K 99.06,68.58 100.33,67.31 105.41,67.31 LED14.K 114.3,68.58 115.57,67.31 121.92,67.31 LED15.K 130.81,68.58 132.08,67.31 138.43,67.31 LED16.K
N$12  (via drill 0.6)
  Top 0.406: v40.64,52.07 6.35,52.07 5.08,53.34 R1.1
  Bottom 0.406: IC2.19 41.91,44.45 40.64,45.72 v40.64,52.07
N$13  (via drill 0.6)
  Top 0.406: R5.2 63.5,11.43 68.58,16.51 v82.55,16.51
  Bottom 0.406: v82.55,16.51 DIS1.13
N$14  (via drill 0.6)
  Top 0.406: R4.2 67.31,16.51 68.58,17.78 v80.01,17.78
  Bottom 0.406: v80.01,17.78 DIS1.14
N$16
  Bottom 0.406: IC2.17 45.72,39.37 46.99,38.1 46.99,22.86 48.26,21.59 R3.1
N$17
  Bottom 0.406: IC2.15 41.91,34.29 40.64,33.02 40.64,22.86 44.45,19.05 44.45,15.24 48.26,11.43 R5.1
N$18
  Bottom 0.406: IC2.16 44.45,36.83 45.72,35.56 45.72,17.78 46.99,16.51 R4.1
N$19  (via drill 0.6)
  Top 0.406: IC2.13 44.45,29.21 45.72,27.94 v62.23,27.94 | S9.3 S9.4 S10.3 S10.4 S11.3 S11.4 S12.3 S12.4 | S12.4 78.69,55.93 78.74,55.88 78.69,55.88 S12.4 | S15.4 S15.3 S14.4 S14.3 S13.4 S13.3 S12.4 | S15.4 128.22,55.93 128.27,55.88 | S15.4 S16.3 S16.4
  Bottom 0.406: v62.23,27.94 62.23,55.83 S11.4
N$20  (via drill 0.6)
  Top 0.406: v39.37,50.8 3.81,50.8 2.54,52.07 R2.1
  Bottom 0.406: IC2.18 40.64,41.91 39.37,43.18 v39.37,50.8
N$21  (via drill 0.6)
  Top 0.406: IC2.14 v48.26,31.75 | S4.3 S3.4 S3.3 S2.4 S2.3 S1.4 S1.3 | S4.3 67.26,80.06 67.31,80.01 | S4.3 77.42,80.06 77.47,80.01 78.59,80.01 S4.4 S5.3 S5.4 S6.3 S6.4 | S6.4 111.71,80.06 111.76,80.01 111.71,80.01 S6.4 | S6.4 S7.3 S7.4 S8.3 S8.4
  Bottom 0.406: v48.26,31.75 48.26,41.91 45.72,44.45 45.72,46.99 44.45,48.26 44.45,50.8 46.99,53.34 46.99,67.31 49.53,69.85 49.53,79.96 S3.3
N$22  (via drill 0.6)
  Top 0.406: IC3.17 RN1.8 148.59,39.37 149.86,40.64 149.86,86.36 147.32,88.9 48.26,88.9 D2.C | v12.7,7.62 13.97,6.35 31.75,6.35 D18.C | v12.7,76.2 41.91,76.2 43.18,77.47 D10.C
  Bottom 0.406: v12.7,7.62 v12.7,76.2 | D2.C D10.C
N$23  (via drill 0.6)
  Top 0.406: IC3.18 RN1.9 148.59,43.18 148.59,81.28 147.32,82.55 v30.48,82.55 | v13.97,88.9 26.67,88.9 27.94,87.63 D1.C
  Bottom 0.406: D17.C 13.97,6.35 v13.97,88.9 | D1.C v30.48,82.55 D9.C
N$24
  Top 0.406: S9.1 S9.2
  Bottom 0.406: S9.2 29.21,61.01 29.21,68.58 D9.A
N$25
  Top 0.406: S2.1 S2.2
  Bottom 0.406: S2.2 45.62,92.61 D2.A
N$26  (via drill 0.6)
  Top 0.406: S23.3 S23.4 S24.3 S24.4 | S17.3 S17.4 S18.3 S18.4 | S19.3 S19.4 S20.3 S20.4 S21.3 S21.4 S22.3 S22.4 113.31,30.76 115.57,33.02 v118.11,33.02 | IC2.12 44.45,26.67 46.99,24.13 v52.63,24.13
  Bottom 0.406: v118.11,33.02 118.11,17.78 120.65,15.24 120.65,11.15 S23.3 | S18.4 49.81,9.17 52.63,11.99 v52.63,24.13 S19.3
N$27
  Bottom 0.406: S17.1 21.87,13.69 22.86,12.7 | 22.86,12.7 D17.A | S17.2 23.85,13.69 22.86,12.7
N$28
  Top 0.406: S18.1 S18.2
  Bottom 0.406: D18.A 40.64,12.7 41.63,13.69 S18.2
N$29
  Top 0.406: S19.1 S19.2
  Bottom 0.406: D19.A 57.15,33.3 S19.2
N$30
  Top 0.406: S20.1 S20.2
  Bottom 0.406: D20.A 73.66,33.3 S20.2
N$31
  Top 0.406: S21.1 S21.2
  Bottom 0.406: D21.A 90.17,33.3 S21.2
N$32
  Top 0.406: S11.1 S11.2
  Bottom 0.406: D11.A 63.5,64.77 62.23,63.5 62.23,61.01 S11.2
N$33
  Top 0.406: S10.1 S10.2
  Bottom 0.406: D10.A 45.72,68.58 45.72,61.01 S10.2
N$34
  Top 0.406: S4.1 S4.2
  Bottom 0.406: S4.2 78.64,92.61 D4.A
N$35
  Top 0.406: S12.1 77.42,60.91 77.47,60.96 78.69,60.96 | 78.74,60.96 78.69,60.96 | 78.69,60.96 S12.2
  Bottom 0.406: D12.A 78.74,68.58 78.74,61.01 S12.2
N$36
  Top 0.406: S3.1 S3.2
  Bottom 0.406: S3.2 62.13,92.61 D3.A
N$37  (via drill 0.6)
  Top 0.406: IC3.16 RN1.7 148.59,36.83 151.13,39.37 151.13,86.36 147.32,90.17 v64.77,90.17
  Bottom 0.406: D19.C 49.53,35.56 50.8,36.83 53.34,36.83 55.88,39.37 55.88,44.45 58.42,46.99 58.42,76.2 59.69,77.47 D11.C D3.C 63.5,88.9 v64.77,90.17
N$38
  Top 0.406: S5.1 S5.2
  Bottom 0.406: S5.2 95.15,93.88 D5.A
N$39
  Top 0.406: S13.1 S13.2
  Bottom 0.406: D13.A 95.25,68.58 95.25,61.01 S13.2
N$40
  Top 0.406: S6.1 S6.2 | S6.2 111.71,85.04 111.76,85.09 111.71,85.09 S6.2
  Bottom 0.406: D6.A 111.76,93.98 111.76,85.14 S6.2
N$41
  Top 0.406: S14.1 S14.2
  Bottom 0.406: D14.A 111.76,68.58 111.76,61.01 S14.2
N$42
  Bottom 0.406: D22.A 106.68,30.48 105.41,31.75 105.41,32.03 | 105.41,32.03 S22.1 | 105.41,32.03 S22.2
N$43
  Top 0.406: S7.1 126.95,85.04 127,85.09 128.12,85.09 S7.2
  Bottom 0.406: D7.A 128.27,93.98 128.27,85.14 S7.2
N$44
  Top 0.406: S15.1 S15.2
  Bottom 0.406: D15.A 128.27,68.58 128.27,61.01 S15.2
N$45
  Top 0.406: S23.2 S23.1
  Bottom 0.406: D23.A 123.19,11.43 124.18,12.7 S23.2
N$46
  Top 0.406: S8.1 S8.2
  Bottom 0.406: D8.A 144.78,93.98 144.78,85.14 S8.2
N$47
  Top 0.406: S16.1 S16.2
  Bottom 0.406: S16.2 144.68,68.48 D16.A
N$48
  Bottom 0.406: D24.A 139.7,7.62 138.43,8.89 138.43,12.7 | S24.1 137.44,13.69 138.43,12.7 | S24.2 139.42,13.69 138.43,12.7
N$49  (via drill 0.6)
  Top 0.406: IC3.15 RN1.6 148.59,34.29 152.4,38.1 152.4,86.36 144.78,93.98 v81.28,93.98 | v68.58,76.2 78.74,76.2 D12.C
  Bottom 0.406: D20.C 66.04,44.45 68.58,46.99 v68.58,76.2 | D12.C D4.C 80.01,92.71 v81.28,93.98
N$50  (via drill 0.6)
  Top 0.406: IC3.14 RN1.5 148.59,31.75 153.67,36.83 153.67,90.17 147.32,96.52 v99.06,96.52 | v82.55,76.2 91.44,76.2 92.71,77.47 D13.C
  Bottom 0.406: D13.C D5.C 96.52,91.44 99.06,93.98 v99.06,96.52 | D21.C 82.55,44.45 85.09,46.99 85.09,62.23 82.55,64.77 v82.55,76.2
N$51  (via drill 0.6)
  Top 0.406: IC3.13 RN1.4 148.59,29.21 154.94,35.56 154.94,90.17 147.32,97.79 v115.57,97.79 | v97.79,76.2 107.95,76.2 109.22,77.47 D14.C
  Bottom 0.406: D14.C D6.C 113.03,91.44 115.57,93.98 v115.57,97.79 | D22.C 97.79,27.94 v97.79,76.2
N$52  (via drill 0.6)
  Top 0.406: IC3.12 RN1.3 148.59,26.67 156.21,34.29 156.21,90.17 147.32,99.06 v132.08,99.06 | v115.57,76.2 124.46,76.2 125.73,77.47 D15.C
  Bottom 0.406: D23.C 115.57,53.34 114.3,54.61 114.3,68.58 115.57,69.85 v115.57,76.2 | D15.C D7.C 129.54,92.71 132.08,95.25 v132.08,99.06
N$53  (via drill 0.6)
  Top 0.406: IC3.11 RN1.2 148.59,22.86 157.48,33.02 v157.48,87.63
  Bottom 0.406: D24.C 132.08,21.59 IC3.11 | D16.C D8.C v157.48,87.63
N$54
  Top 0.406: S1.1 S1.2
  Bottom 0.406: D1.A 29.11,92.61 S1.2
ROW_EN
  Top 0.406: SV1.8 6.35,30.48 6.35,26.67 6.35,21.59 7.62,20.32 12.7,20.32 30.48,20.32 31.75,21.59 41.91,21.59 IC2.11
SWITCHCOL_EN  (via drill 0.6)
  Top 0.406: SV1.10 6.35,35.56 5.08,34.29 5.08,10.16 12.7,2.54 128.27,2.54 v129.54,3.81
  Bottom 0.406: v129.54,3.81 129.54,43.18 130.81,44.45 IC3.19
VCC
  Top 0.61: 41.91,48.26 34.29,48.26 33.02,46.99 IC1.20 20.32,46.99 19.05,48.26 10.16,48.26 8.89,46.99 SV1.16 | 41.91,48.26 IC2.20 | C2.1 41.91,48.26
  Bottom 0.61: C3.1 IC3.20 132.08,46.99 128.27,43.18 128.27,3.81 125.73,1.27 13.97,1.27 6.35,8.89 6.35,38.1 SV1.14 SV1.16 | C1.1 IC1.20

### Text on the board
Top: J.F.
tNames: SQ1 | SQ2 | TRI | NOISE | DMC | LFO1 | LFO2 | LFO3 | DUTY | GLIDE | DETUNE | ENVMOD | A | D | S | R | Front panel board v0.4 | PROGRAM | PATTERN | TRACK | SETTINGS | SAVE | OK | UP | DOWN